# Altium schematic sheet IDC_EXT_Connectors.SchDoc: =ProjectName
size 420 x 297 mm; Author: Paweł Kulik; CompanyName: WUT; DrawnBy: Paweł Kulik; Organization: WUT ISE; Address1: Warsaw Univeristy of Technology; Address2: Nowowiejska 15/19; DocumentNumber: 3; Revision: 2.0; SheetNumber: 11; SheetTotal: 11; EDA_Number: ARTIQ; Projet: ARTIQ/SINARA; ModifiedBy: -; CheckedDate: -; Title2: IDC_EXT_Connectors.SchDoc; DivGrp: ISE; Designer: Paweł Kulik; ModifiedDate: -; ProjectName: ARTIQ/SINARA
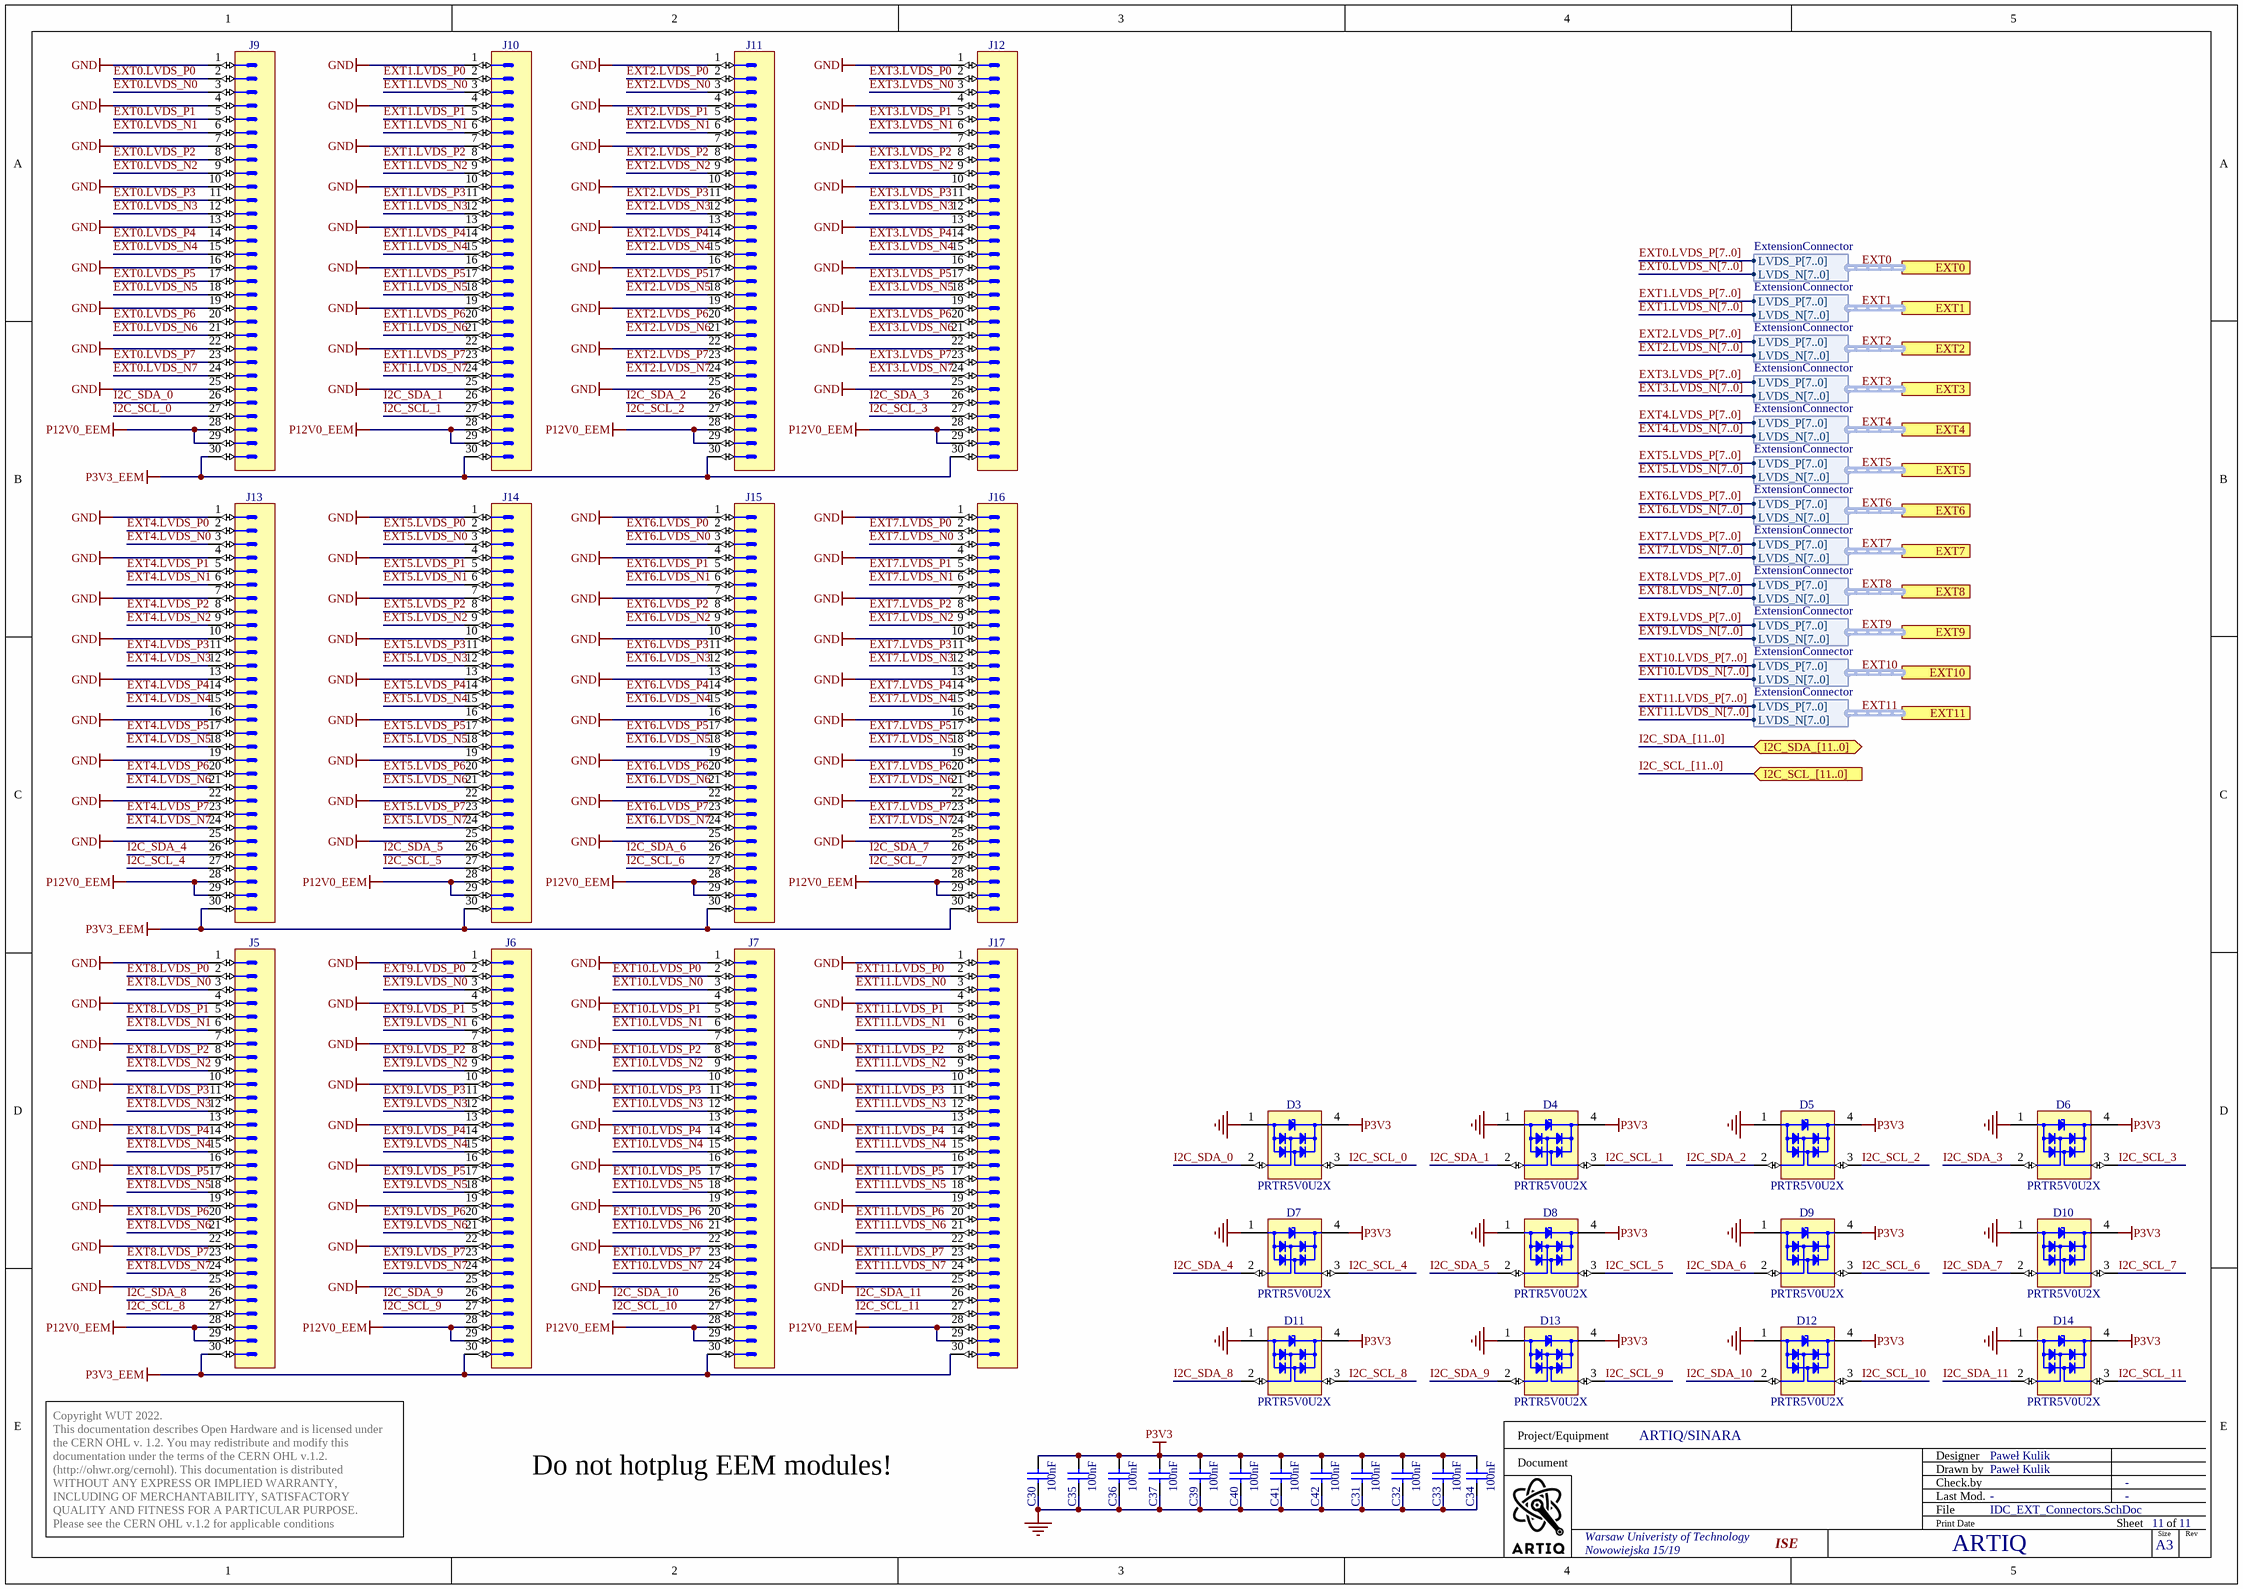
[diagram p0: IDC_EXT_Connectors.SchDoc]

## Parts
C30  100nF  [CAPC0603X33N]
C31  100nF  [CAPC0603X33N]
C32  100nF  [CAPC0603X33N]
C33  100nF  [CAPC0603X33N]
C34  100nF  [CAPC0603X33N]
C35  100nF  [CAPC0603X33N]
C36  100nF  [CAPC0603X33N]
C37  100nF  [CAPC0603X33N]
C39  100nF  [CAPC0603X33N]
C40  100nF  [CAPC0603X33N]
C41  100nF  [CAPC0603X33N]
C42  100nF  [CAPC0603X33N]
D3  PRTR5V0U2X  [SOT190P230X110-4N]
D4  PRTR5V0U2X  [SOT190P230X110-4N]
D5  PRTR5V0U2X  [SOT190P230X110-4N]
D6  PRTR5V0U2X  [SOT190P230X110-4N]
D7  PRTR5V0U2X  [SOT190P230X110-4N]
D8  PRTR5V0U2X  [SOT190P230X110-4N]
D9  PRTR5V0U2X  [SOT190P230X110-4N]
D10  PRTR5V0U2X  [SOT190P230X110-4N]
D11  PRTR5V0U2X  [SOT190P230X110-4N]
D12  PRTR5V0U2X  [SOT190P230X110-4N]
D13  PRTR5V0U2X  [SOT190P230X110-4N]
D14  PRTR5V0U2X  [SOT190P230X110-4N]
J5  (no value)  [3M_N2530-6002RB]
J6  (no value)  [3M_N2530-6002RB]
J7  (no value)  [3M_N2530-6002RB]
J9  (no value)  [3M_N2530-6002RB]
J10  (no value)  [3M_N2530-6002RB]
J11  (no value)  [3M_N2530-6002RB]
J12  (no value)  [3M_N2530-6002RB]
J13  (no value)  [3M_N2530-6002RB]
J14  (no value)  [3M_N2530-6002RB]
J15  (no value)  [3M_N2530-6002RB]
J16  (no value)  [3M_N2530-6002RB]
J17  (no value)  [3M_N2530-6002RB]

## Ports
EXT0 (harness ExtensionConnector), EXT1 (harness ExtensionConnector), EXT2 (harness ExtensionConnector), EXT3 (harness ExtensionConnector), EXT4 (harness ExtensionConnector), EXT5 (harness ExtensionConnector), EXT6 (harness ExtensionConnector), EXT7 (harness ExtensionConnector), EXT8 (harness ExtensionConnector), EXT9 (harness ExtensionConnector), EXT10 (harness ExtensionConnector), EXT11 (harness ExtensionConnector), I2C_SCL_[11..0] (in), I2C_SDA_[11..0] (bidir)

## Harnesses
ExtensionConnector: LVDS_N[7..0], LVDS_P[7..0]

## Nets
GND: C30.1 C31.1 C32.1 C33.1 C34.1 C35.1 C36.1 C37.1 C39.1 C40.1 C41.1 C42.1 D3.1(GND) D4.1(GND) D5.1(GND) D6.1(GND) D7.1(GND) D8.1(GND) D9.1(GND) D10.1(GND) D11.1(GND) D12.1(GND) D13.1(GND) D14.1(GND) J5.1 J5.4 J5.7 J5.10 J5.13 J5.16 J5.19 J5.22 J5.25 J6.1 J6.4 J6.7 J6.10 J6.13 J6.16 J6.19 J6.22 J6.25 J7.1 J7.4 J7.7 J7.10 J7.13 J7.16 J7.19 J7.22 J7.25 J9.1 J9.4 J9.7 J9.10 J9.13 J9.16 J9.19 J9.22 J9.25 J10.1 J10.4 J10.7 J10.10 J10.13 J10.16 J10.19 J10.22 J10.25 J11.1 J11.4 J11.7 J11.10 J11.13 J11.16 J11.19 J11.22 J11.25 J12.1 J12.4 J12.7 J12.10 J12.13 J12.16 J12.19 J12.22 J12.25 J13.1 J13.4 J13.7 J13.10 J13.13 J13.16 J13.19 J13.22 J13.25 J14.1 J14.4 J14.7 J14.10 J14.13 J14.16 J14.19 J14.22 J14.25 J15.1 J15.4 J15.7 J15.10 J15.13 J15.16 J15.19 J15.22 J15.25 J16.1 J16.4 J16.7 J16.10 J16.13 J16.16 J16.19 J16.22 J16.25 J17.1 J17.4 J17.7 J17.10 J17.13 J17.16 J17.19 J17.22 J17.25
P3V3: C30.2 C31.2 C32.2 C33.2 C34.2 C35.2 C36.2 C37.2 C39.2 C40.2 C41.2 C42.2 D3.4(VCC) D4.4(VCC) D5.4(VCC) D6.4(VCC) D7.4(VCC) D8.4(VCC) D9.4(VCC) D10.4(VCC) D11.4(VCC) D12.4(VCC) D13.4(VCC) D14.4(VCC)
P3V3_EEM: J5.30 J6.30 J7.30 J9.30 J10.30 J11.30 J12.30 J13.30 J14.30 J15.30 J16.30 J17.30
P12V0_EEM: J5.28 J5.29 J6.28 J6.29 J7.28 J7.29 J9.28 J9.29 J10.28 J10.29 J11.28 J11.29 J12.28 J12.29 J13.28 J13.29 J14.28 J14.29 J15.28 J15.29 J16.28 J16.29 J17.28 J17.29
EXT0.LVDS_N0: J9.3
EXT0.LVDS_N1: J9.6
EXT0.LVDS_N2: J9.9
EXT0.LVDS_N3: J9.12
EXT0.LVDS_N4: J9.15
EXT0.LVDS_N5: J9.18
EXT0.LVDS_N6: J9.21
EXT0.LVDS_N7: J9.24
EXT0.LVDS_P0: J9.2
EXT0.LVDS_P1: J9.5
EXT0.LVDS_P2: J9.8
EXT0.LVDS_P3: J9.11
EXT0.LVDS_P4: J9.14
EXT0.LVDS_P5: J9.17
EXT0.LVDS_P6: J9.20
EXT0.LVDS_P7: J9.23
EXT1.LVDS_N0: J10.3
EXT1.LVDS_N1: J10.6
EXT1.LVDS_N2: J10.9
EXT1.LVDS_N3: J10.12
EXT1.LVDS_N4: J10.15
EXT1.LVDS_N5: J10.18
EXT1.LVDS_N6: J10.21
EXT1.LVDS_N7: J10.24
EXT1.LVDS_P0: J10.2
EXT1.LVDS_P1: J10.5
EXT1.LVDS_P2: J10.8
EXT1.LVDS_P3: J10.11
EXT1.LVDS_P4: J10.14
EXT1.LVDS_P5: J10.17
EXT1.LVDS_P6: J10.20
EXT1.LVDS_P7: J10.23
EXT2.LVDS_N0: J11.3
EXT2.LVDS_N1: J11.6
EXT2.LVDS_N2: J11.9
EXT2.LVDS_N3: J11.12
EXT2.LVDS_N4: J11.15
EXT2.LVDS_N5: J11.18
EXT2.LVDS_N6: J11.21
EXT2.LVDS_N7: J11.24
EXT2.LVDS_P0: J11.2
EXT2.LVDS_P1: J11.5
EXT2.LVDS_P2: J11.8
EXT2.LVDS_P3: J11.11
EXT2.LVDS_P4: J11.14
EXT2.LVDS_P5: J11.17
EXT2.LVDS_P6: J11.20
EXT2.LVDS_P7: J11.23
EXT3.LVDS_N0: J12.3
EXT3.LVDS_N1: J12.6
EXT3.LVDS_N2: J12.9
EXT3.LVDS_N3: J12.12
EXT3.LVDS_N4: J12.15
EXT3.LVDS_N5: J12.18
EXT3.LVDS_N6: J12.21
EXT3.LVDS_N7: J12.24
EXT3.LVDS_P0: J12.2
EXT3.LVDS_P1: J12.5
EXT3.LVDS_P2: J12.8
EXT3.LVDS_P3: J12.11
EXT3.LVDS_P4: J12.14
EXT3.LVDS_P5: J12.17
EXT3.LVDS_P6: J12.20
EXT3.LVDS_P7: J12.23
EXT4.LVDS_N0: J13.3
EXT4.LVDS_N1: J13.6
EXT4.LVDS_N2: J13.9
EXT4.LVDS_N3: J13.12
EXT4.LVDS_N4: J13.15
EXT4.LVDS_N5: J13.18
EXT4.LVDS_N6: J13.21
EXT4.LVDS_N7: J13.24
EXT4.LVDS_P0: J13.2
EXT4.LVDS_P1: J13.5
EXT4.LVDS_P2: J13.8
EXT4.LVDS_P3: J13.11
EXT4.LVDS_P4: J13.14
EXT4.LVDS_P5: J13.17
EXT4.LVDS_P6: J13.20
EXT4.LVDS_P7: J13.23
EXT5.LVDS_N0: J14.3
EXT5.LVDS_N1: J14.6
EXT5.LVDS_N2: J14.9
EXT5.LVDS_N3: J14.12
EXT5.LVDS_N4: J14.15
EXT5.LVDS_N5: J14.18
EXT5.LVDS_N6: J14.21
EXT5.LVDS_N7: J14.24
EXT5.LVDS_P0: J14.2
EXT5.LVDS_P1: J14.5
EXT5.LVDS_P2: J14.8
EXT5.LVDS_P3: J14.11
EXT5.LVDS_P4: J14.14
EXT5.LVDS_P5: J14.17
EXT5.LVDS_P6: J14.20
EXT5.LVDS_P7: J14.23
EXT6.LVDS_N0: J15.3
EXT6.LVDS_N1: J15.6
EXT6.LVDS_N2: J15.9
EXT6.LVDS_N3: J15.12
EXT6.LVDS_N4: J15.15
EXT6.LVDS_N5: J15.18
EXT6.LVDS_N6: J15.21
EXT6.LVDS_N7: J15.24
EXT6.LVDS_P0: J15.2
EXT6.LVDS_P1: J15.5
EXT6.LVDS_P2: J15.8
EXT6.LVDS_P3: J15.11
EXT6.LVDS_P4: J15.14
EXT6.LVDS_P5: J15.17
EXT6.LVDS_P6: J15.20
EXT6.LVDS_P7: J15.23
EXT7.LVDS_N0: J16.3
EXT7.LVDS_N1: J16.6
EXT7.LVDS_N2: J16.9
EXT7.LVDS_N3: J16.12
EXT7.LVDS_N4: J16.15
EXT7.LVDS_N5: J16.18
EXT7.LVDS_N6: J16.21
EXT7.LVDS_N7: J16.24
EXT7.LVDS_P0: J16.2
EXT7.LVDS_P1: J16.5
EXT7.LVDS_P2: J16.8
EXT7.LVDS_P3: J16.11
EXT7.LVDS_P4: J16.14
EXT7.LVDS_P5: J16.17
EXT7.LVDS_P6: J16.20
EXT7.LVDS_P7: J16.23
EXT8.LVDS_N0: J5.3
EXT8.LVDS_N1: J5.6
EXT8.LVDS_N2: J5.9
EXT8.LVDS_N3: J5.12
EXT8.LVDS_N4: J5.15
EXT8.LVDS_N5: J5.18
EXT8.LVDS_N6: J5.21
EXT8.LVDS_N7: J5.24
EXT8.LVDS_P0: J5.2
EXT8.LVDS_P1: J5.5
EXT8.LVDS_P2: J5.8
EXT8.LVDS_P3: J5.11
EXT8.LVDS_P4: J5.14
EXT8.LVDS_P5: J5.17
EXT8.LVDS_P6: J5.20
EXT8.LVDS_P7: J5.23
EXT9.LVDS_N0: J6.3
EXT9.LVDS_N1: J6.6
EXT9.LVDS_N2: J6.9
EXT9.LVDS_N3: J6.12
EXT9.LVDS_N4: J6.15
EXT9.LVDS_N5: J6.18
EXT9.LVDS_N6: J6.21
EXT9.LVDS_N7: J6.24
EXT9.LVDS_P0: J6.2
EXT9.LVDS_P1: J6.5
EXT9.LVDS_P2: J6.8
EXT9.LVDS_P3: J6.11
EXT9.LVDS_P4: J6.14
EXT9.LVDS_P5: J6.17
EXT9.LVDS_P6: J6.20
EXT9.LVDS_P7: J6.23
EXT10.LVDS_N0: J7.3
EXT10.LVDS_N1: J7.6
EXT10.LVDS_N2: J7.9
EXT10.LVDS_N3: J7.12
EXT10.LVDS_N4: J7.15
EXT10.LVDS_N5: J7.18
EXT10.LVDS_N6: J7.21
EXT10.LVDS_N7: J7.24
EXT10.LVDS_P0: J7.2
EXT10.LVDS_P1: J7.5
EXT10.LVDS_P2: J7.8
EXT10.LVDS_P3: J7.11
EXT10.LVDS_P4: J7.14
EXT10.LVDS_P5: J7.17
EXT10.LVDS_P6: J7.20
EXT10.LVDS_P7: J7.23
EXT11.LVDS_N0: J17.3
EXT11.LVDS_N1: J17.6
EXT11.LVDS_N2: J17.9
EXT11.LVDS_N3: J17.12
EXT11.LVDS_N4: J17.15
EXT11.LVDS_N5: J17.18
EXT11.LVDS_N6: J17.21
EXT11.LVDS_N7: J17.24
EXT11.LVDS_P0: J17.2
EXT11.LVDS_P1: J17.5
EXT11.LVDS_P2: J17.8
EXT11.LVDS_P3: J17.11
EXT11.LVDS_P4: J17.14
EXT11.LVDS_P5: J17.17
EXT11.LVDS_P6: J17.20
EXT11.LVDS_P7: J17.23
I2C_SCL_0: D3.3(I/O2) J9.27
I2C_SCL_1: D4.3(I/O2) J10.27
I2C_SCL_2: D5.3(I/O2) J11.27
I2C_SCL_3: D6.3(I/O2) J12.27
I2C_SCL_4: D7.3(I/O2) J13.27
I2C_SCL_5: D8.3(I/O2) J14.27
I2C_SCL_6: D9.3(I/O2) J15.27
I2C_SCL_7: D10.3(I/O2) J16.27
I2C_SCL_8: D11.3(I/O2) J5.27
I2C_SCL_9: D13.3(I/O2) J6.27
I2C_SCL_10: D12.3(I/O2) J7.27
I2C_SCL_11: D14.3(I/O2) J17.27
I2C_SDA_0: D3.2(I/O1) J9.26
I2C_SDA_1: D4.2(I/O1) J10.26
I2C_SDA_2: D5.2(I/O1) J11.26
I2C_SDA_3: D6.2(I/O1) J12.26
I2C_SDA_4: D7.2(I/O1) J13.26
I2C_SDA_5: D8.2(I/O1) J14.26
I2C_SDA_6: D9.2(I/O1) J15.26
I2C_SDA_7: D10.2(I/O1) J16.26
I2C_SDA_8: D11.2(I/O1) J5.26
I2C_SDA_9: D13.2(I/O1) J6.26
I2C_SDA_10: D12.2(I/O1) J7.26
I2C_SDA_11: D14.2(I/O1) J17.26

## Buses and harness runs
bus EXT0.LVDS_N[7..0]
bus EXT0.LVDS_P[7..0]
bus EXT1.LVDS_N[7..0]
bus EXT1.LVDS_P[7..0]
bus EXT2.LVDS_N[7..0]
bus EXT2.LVDS_P[7..0]
bus EXT3.LVDS_N[7..0]
bus EXT3.LVDS_P[7..0]
bus EXT4.LVDS_N[7..0]
bus EXT4.LVDS_P[7..0]
bus EXT5.LVDS_N[7..0]
bus EXT5.LVDS_P[7..0]
bus EXT6.LVDS_N[7..0]
bus EXT6.LVDS_P[7..0]
bus EXT7.LVDS_N[7..0]
bus EXT7.LVDS_P[7..0]
bus EXT8.LVDS_N[7..0]
bus EXT8.LVDS_P[7..0]
bus EXT9.LVDS_N[7..0]
bus EXT9.LVDS_P[7..0]
bus EXT10.LVDS_N[7..0]
bus EXT10.LVDS_P[7..0]
bus EXT11.LVDS_N[7..0]
bus EXT11.LVDS_P[7..0]
bus I2C_SCL_[11..0] = port I2C_SCL_[11..0]
bus I2C_SDA_[11..0] = port I2C_SDA_[11..0]
harness EXT0 = port EXT0
harness EXT1 = port EXT1
harness EXT2 = port EXT2
harness EXT3 = port EXT3
harness EXT4 = port EXT4
harness EXT5 = port EXT5
harness EXT6 = port EXT6
harness EXT7 = port EXT7
harness EXT8 = port EXT8
harness EXT9 = port EXT9
harness EXT10 = port EXT10
harness EXT11 = port EXT11

## Notes on the sheet
- Do not hotplug EEM modules!
- Project/Equipment
- Document
- Designer
- Drawn by
- Check.by
- Copyright WUT 2022.
  This documentation describes Open Hardware and is licensed under the CERN OHL v. 1.2. You may redistribute and modify this documentation under the terms of the CERN OHL v.1.2. (http://ohwr.org/cernohl). This documentation is distributed WITHOUT ANY EXPRESS OR IMPLIED WARRANTY, INCLUDING OF MERCHANTABILITY, SATISFACTORY QUALITY AND FITNESS FOR A PARTICULAR PURPOSE. Please see the CERN OHL v.1.2 for applicable conditions
- File
- Last Mod.
- Print Date
- Sheet
- Size
- A3
- of
- Rev

## Library data of the parts
C30-C37 C39-C42 = CC0201_100NF_6.3V_10%_X5R: Non-polarised capacitor; Part Description: SMD Multilayer Chip Ceramic Capacitor; Manufacturer: GENERIC; Manufacturer1 Part Number: 02016D104KAT2A; Voltage: 6.3V; TC: X5R; Tolerance: ±10%; Part Number: CC0201_100NF_6.3V_10%_X5R; Component Kind: Standard; Component Type: Standard; Pin Count: 2; Value: 100nF; Status: Not Recommended; Manufacturer Part Number: CC0201_100NF_6.3V_10%_X5R; Case: 0201; Mounted: Yes; Socket: No; SMD: Yes; Sense: No; Manufacturer1 Example: AVX; Manufacturer1 ComponentHeight: 0.33mm; HelpURL: \\cern.ch\dfs\Applications\Altium\Datasheets\CC0201_X5R_AVX.pdf; Author: CERN DEM JLC; CreateDate: 2007-12-03; LatestRevisionDate: 2007-12-03
D3-D14 = PRTR5V0U2X: Ultra Low Capacitance Double Rail-to-Rail ESD Protection Diode; Part Description: Ultra Low Capacitance (1pF) Double Rail-to-Rail ESD Protection Diode (8kV); Manufacturer: NXP SEMICONDUCTORS; Voltage: 5.5V; PressFit: No; Bonding: No; Part Number: PRTR5V0U2X; Component Kind: Standard; Component Type: Standard; Device: PRTR5V0U2X; PackageDescription: SOT143B, SOT, 1.90mm Pitch; 4 Pin, 1.30mm W X 2.90mm L X 1.10mm H body, IPC Medium Density; Manufacturer Part Number: PRTR5V0U2X; Pin Count: 4; Case: SOT143B; Mounted: Yes; Socket: No; SMD: Yes; Sense: No; ComponentHeight: 1.1mm; HelpURL: \\cern.ch\dfs\Applications\Altium\Datasheets\PRTR5V0U2X.pdf; Author: CERN DEM JLC; CreateDate: 22.03.2011; LatestRevisionDate: 22.03.2011
J5-J7 J9-J17 = 3M_N2530-6002RB: Connector 30 Male; Part Description: 30 Contacts - Straight .100'' x .100'' Low Profile Four-Wall Header, 2500 Series; Manufacturer: 3M; PressFit: No; Part Number: 3M_N2530-6002RB; Component Kind: Standard; Component Type: Standard; Pin Count: 30; Family: Header 30; Mounted: Yes; Socket: No; SMD: No; Sense: No; Status: None; Manufacturer Part Number: N2530-6002RB; ComponentHeight: 10.03mm; HelpURL: \\cern.ch\dfs\Applications\Altium\Datasheets\3M_N2530-6002RB.pdf; Author: CERN DEM JLC; CreateDate: 11.02.2009; LatestRevisionDate: 11.08.2009